# Altium schematic sheet RTU_B2_Battery.SchDoc
size A4; SheetNumber: 11; SheetTotal: 14
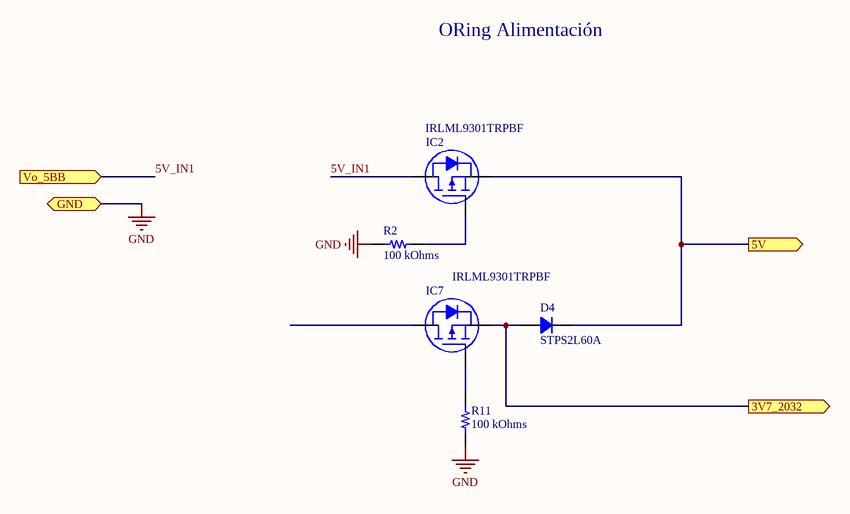
[diagram p0: RTU_B2_Battery.SchDoc]

## Parts
D4  STPS2L60A  [DO214AC SMA]
IC2  IRLML9301TRPBF  [INFINEON SOT-23-3]
IC7  IRLML9301TRPBF  [INFINEON SOT-23-3]
R2  100 kOhms  [RES 0603_1608]
R11  100 kOhms  [RES 0603_1608]

## Ports
3V7_2032 (out), 5V (out), GND (bidir), Vo_5BB (in)

## Nets
GND: R2.1 R11.1 ; port GND
3V7_2032: D4.1 IC7.2(S) ; port 3V7_2032
5V: D4.2 IC2.2(S) ; port 5V
5V_IN1: IC2.3(D) ; port Vo_5BB
NetIC2_1: IC2.1(G) R2.2
NetIC7_1: IC7.1(G) R11.2

Not connected (* = marked no-connect by the designer): IC7 3(D)

## Notes on the sheet
- ORing Alimentación

## Library data of the parts
D4 = STPS2L60A: DIODE SCHOTTKY 60V 2A SMA; Manufacturer: STMicroelectronics; Current - Reverse Leakage @ Vr: 100 µA @ 60 V; Speed: Fast Recovery =< 500ns, > 200mA (Io); Voltage - Forward (Vf) (Max) @ If: 600 mV @ 2 A; Part Number: STPS2L60A; ComponentLink1Description: Datasheet; ComponentLink1URL: http://www.st.com/content/ccc/resource/technical/document/datasheet/b7/ac/e1/7d/2a/e9/4b/e8/CD00003166.pdf/files/CD00003166.pdf/jcr:content/translations/en.CD00003166.pdf; ComponentLink2Description: DigiKey Link; ComponentLink2URL: https://www.digikey.com/en/products/detail/stmicroelectronics/STPS2L60A/603486; Current - Average Rectified (Io): 2A; Diode Type: Schottky; LastUpdated: 3/6/2024 19:54:31; Lifecycle Status: Active; Minimum Order: 1; Mounting Type: Surface Mount; Operating Temperature - Junction: 150°C (Max); Package / Case: DO-214AC, SMA; Packaging: TapeAndReel; PartId: 2074; Part Status: Active; Price: 0.18; Series: -; Supplier 1: DigiKey; Supplier Part Number 1: 497-2461-1-ND; Supplier Device Package: SMA (DO-214AC); Voltage - DC Reverse (Vr) (Max): 60 V
IC2 IC7 = IRLML9301TRPBF: MOSFET P-CH 30V 3.6A SOT23; Manufacturer: Infineon Technologies; Current - Continuous Drain (Id) @ 25°C: 3.6A (Ta); Drive Voltage (Max Rds On,  Min Rds On): 4.5V, 10V; FET Type: P-Channel; Gate Charge (Qg) (Max) @ Vgs: 4.8 nC @ 4.5 V; Input Capacitance (Ciss) (Max) @ Vds: 388 pF @ 25 V; Power Dissipation (Max): 1.3W (Ta); Rds On (Max) @ Id, Vgs: 64mOhm @ 3.6A, 10V; Vgs (Max): ±20V; Vgs(th) (Max) @ Id: 2.4V @ 10µA; Part Number: IRLML9301TRPBF; ComponentLink1Description: Datasheet; ComponentLink1URL: https://www.infineon.com/dgdl/irlml9301pbf.pdf?fileId=5546d462533600a401535668e5e42640; ComponentLink2Description: DigiKey Link; ComponentLink2URL: https://www.digikey.com/en/products/detail/infineon-technologies/IRLML9301TRPBF/2354146; Drain to Source Voltage (Vdss): 30 V; LastUpdated: 3/6/2024 20:15:24; Lifecycle Status: Active; Minimum Order: 1; Mounting Type: Surface Mount; Operating Temperature: -55°C ~ 150°C (TJ); Package / Case: TO-236-3, SC-59, SOT-23-3; Packaging: TapeAndReel; Part Status: Active; Price: 0.09; Series: HEXFET®; Supplier 1: DigiKey; Supplier Part Number 1: IRLML9301TRPBFCT-ND; Supplier Device Package: Micro3™/SOT-23; Technology: MOSFET (Metal Oxide)
R2 R11 = RNCS0603BKE100K: RES 100K OHM 0.1% 1/16W 0603; Manufacturer: Stackpole Electronics Inc; Power (Watts): 0.063W, 1/16W; Temperature Coefficient: ±25ppm/°C; Part Number: RNCS0603BKE100K; Value: 100 kOhms; ComponentLink1Description: Datasheet; ComponentLink1URL: https://www.seielect.com/catalog/sei-rncs_rnch.pdf; ComponentLink2Description: DigiKey Link; ComponentLink2URL: https://www.digikey.com/en/products/detail/stackpole-electronics-inc/RNCS0603BKE100K/1708835; Composition: Thin Film; Device Package: 0603 (1608 Metric); Features: Anti-Corrosive, Automotive AEC-Q200, Moisture Resistant; Height - Seated (Max): 0.022" (0.55mm); LastUpdated: 9/2/2024 20:43:37; Lifecycle Status: Active; Minimum Order: 1; Number of Terminations: 2; Operating Temperature: -55°C ~ 155°C; Package / Case: 0603 (1608 Metric); Packaging: TapeAndReel; PartId: 4849; Part Status: Active; Price: 0.06; Ratings: AEC-Q200; Resistance: 100 kOhms; Series: RNCS; Size / Dimension: 0.061" L x 0.031" W (1.55mm x 0.80mm); Supplier 1: DigiKey; Supplier Part Number 1: RNCS0603BKE100KCT-ND; Supplier Device Package: 0603; Tolerance: ±0.1%